# Altium schematic sheet 3.DAC_Control_CH1_V2.0-2.4.SchDoc
size A4
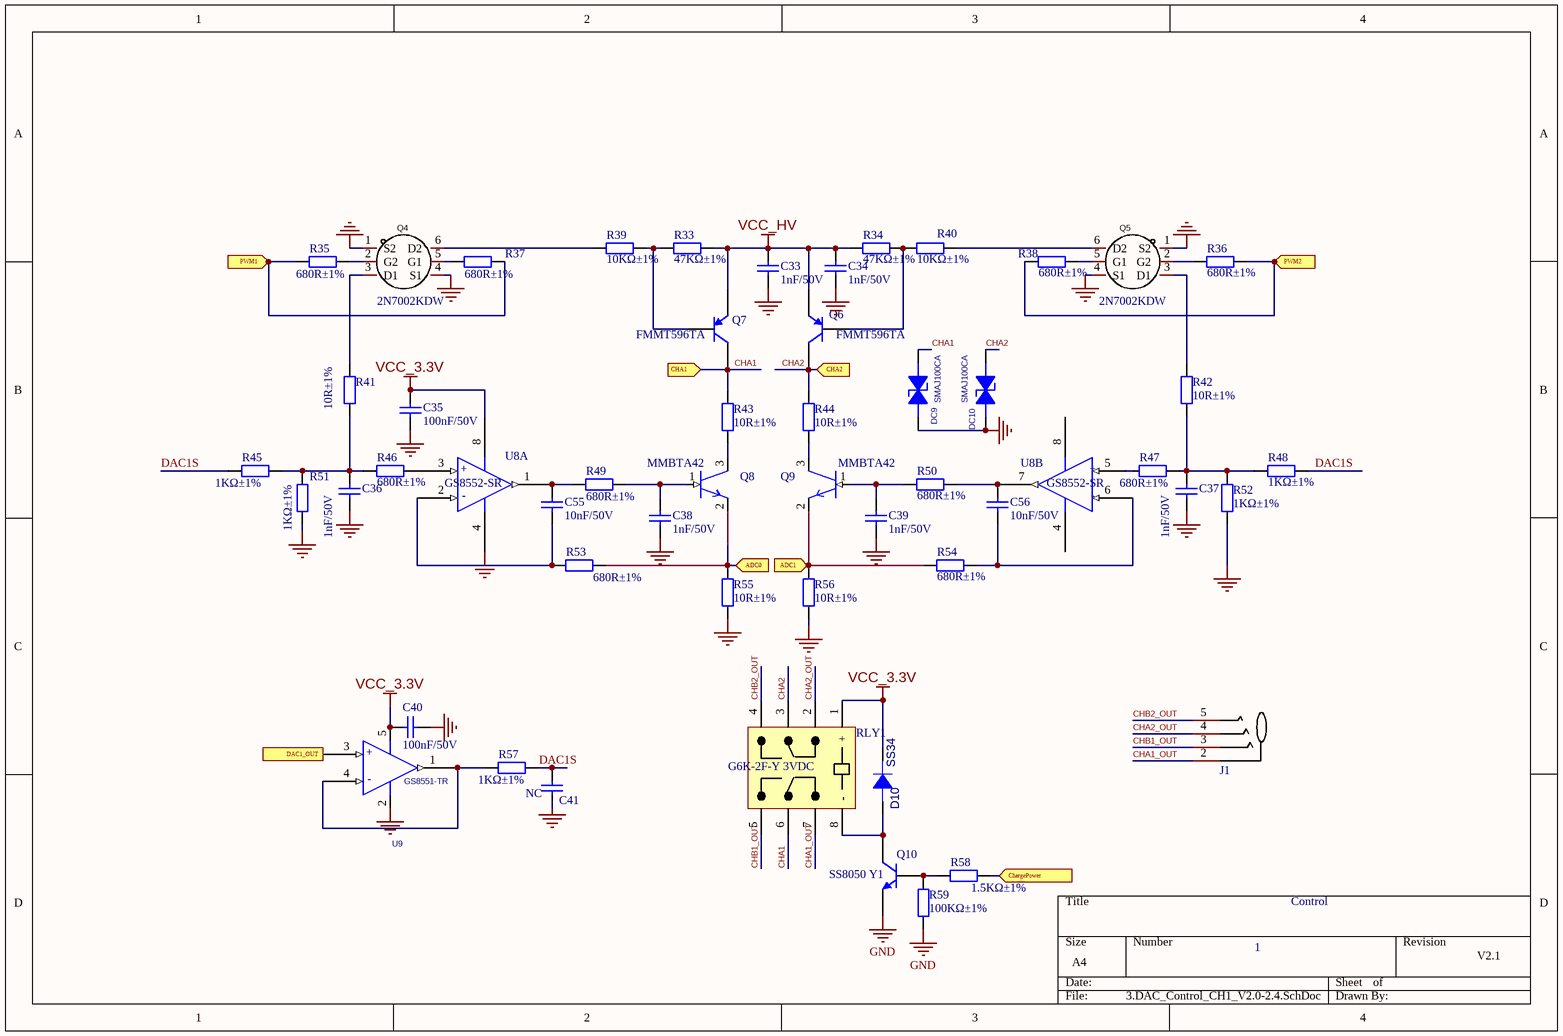
[diagram p0: 3.DAC_Control_CH1_V2.0-2.4.SchDoc]

## Parts
C33  1nF/50V  [0603C]
C34  1nF/50V  [0603C]
C35  100nF/50V  [0603C]
C36  1nF/50V  [0603C]
C37  1nF/50V  [0603C]
C38  1nF/50V  [0603C]
C39  1nF/50V  [0603C]
C40  100nF/50V  [0603C]
C41  NC  [0603C]
C55  10nF/50V  [0603C]
C56  10nF/50V  [0603C]
D10  SS34  [SMA]
DC9  SMAJ100CA  [SMA]
DC10  SMAJ100CA  [SMA]
J1  PJ-320D 贴片4脚  [AUDIO-TH_L14.1-W6.1_PJ-320D]  (value not drawn)
Q4  2N7002KDW  [SOT-363]
Q5  2N7002KDW  [SOT-363]
Q6  FMMT596TA  [SOT-23(SOT-23-3)]
Q7  FMMT596TA  [SOT-23(SOT-23-3)]
Q8  MMBTA42  [SOT-23]
Q9  MMBTA42  [SOT-23]
Q10  SS8050 Y1  [SOT-23(SOT-23-3)]
R33  47KΩ±1%  [0603R]
R34  47KΩ±1%  [0603R]
R35  680R±1%  [0603R]
R36  680R±1%  [0603R]
R37  680R±1%  [0603R]
R38  680R±1%  [0603R]
R39  10KΩ±1%  [0603R]
R40  10KΩ±1%  [0603R]
R41  10R±1%  [0603R]
R42  10R±1%  [0603R]
R43  10R±1%  [0805_R]
R44  10R±1%  [0805_R]
R45  1KΩ±1%  [0603R]
R46  680R±1%  [0603R]
R47  680R±1%  [0603R]
R48  1KΩ±1%  [0603R]
R49  680R±1%  [0603R]
R50  680R±1%  [0603R]
R51  1KΩ±1%  [0603R]
R52  1KΩ±1%  [0603R]
R53  680R±1%  [0603R]
R54  680R±1%  [0603R]
R55  10R±1%  [0805_R]
R56  10R±1%  [0805_R]
R57  1KΩ±1%  [0603R]
R58  1.5KΩ±1%  [0402_R]
R59  100KΩ±1%  [0402_R]
RLY1  G6K-2F-Y 3VDC  [HFD4/12]
U8  GS8552-SR  [SOP-8_150mil]  (parts A,B of 2)
U9  GS8551-TR  [SOT-23-5]

## Ports
ADC0 (in), ADC1 (in), CHA1 (in), CHA2 (in), ChargePower (in), DAC1_OUT (in), PWM1 (in), PWM2 (in)

## Nets
GND: C33.1 C34.1 C35.1 C36.1 C37.1 C38.1 C39.1 C40.1 C41.1 DC9.2(CATHODE) DC10.2(CATHODE) Q4.1(S2) Q4.4(S1) Q5.1(S2) Q5.4(S1) Q10.2(E) R51.1 R52.1 R55.1 R56.1 R59.1 U8.4(GND) U9.2(V-)
VCC_3.3V: C35.2 C40.2 D10.2(K) RLY1.1(+) U8.8(VCC) U9.5(V+)
VCC_HV: C33.2 C34.2 Q6.2(E) Q7.2(E) R33.1 R34.1
ADC0: Q8.2 R53.2 R55.2 ; port ADC0
ADC1: Q9.2 R54.2 R56.2 ; port ADC1
CHA1: DC9.1(ANODE) Q7.3(C) R43.2 RLY1.6 ; port CHA1
CHA1_OUT: J1.2 RLY1.7
CHA2: DC10.1(ANODE) Q6.3(C) R44.2 RLY1.3 ; port CHA2
CHA2_OUT: J1.4 RLY1.2
ChargePower: R58.1 ; port ChargePower
CHB1_OUT: J1.3 RLY1.5
CHB2_OUT: J1.5 RLY1.4
DAC1_OUT: U9.3(IN+) ; port DAC1_OUT
DAC1S: C41.2 R45.1 R48.1 R57.1
PWM1: R35.1 R37.2 ; port PWM1
PWM2: R36.1 R38.2 ; port PWM2
NetC36_2: C36.2 R41.1 R45.2 R46.1 R51.2
NetC37_2: C37.2 R42.1 R47.1 R48.2 R52.2
NetC38_2: C38.2 Q8.1 R49.2
NetC39_2: C39.2 Q9.1 R50.2
NetC55_1: C55.1 R53.1 U8.2(-IN)
NetC55_2: C55.2 R49.1 U8.1(OUT)
NetC56_1: C56.1 R54.1 U8.6(-IN)
NetC56_2: C56.2 R50.1 U8.7(OUT)
NetD10_1: D10.1(A) Q10.3(C) RLY1.8(-)
NetQ4_2: Q4.2(G2) R35.2
NetQ4_3: Q4.3(D1) R41.2
NetQ4_5: Q4.5(G1) R37.1
NetQ4_6: Q4.6(D2) R39.2
NetQ5_2: Q5.2(G2) R36.2
NetQ5_3: Q5.3(D1) R42.2
NetQ5_5: Q5.5(G1) R38.1
NetQ5_6: Q5.6(D2) R40.2
NetQ6_1: Q6.1(B) R34.2 R40.1
NetQ7_1: Q7.1(B) R33.2 R39.1
NetQ8_3: Q8.3 R43.1
NetQ9_3: Q9.3 R44.1
NetQ10_1: Q10.1(B) R58.2 R59.2
NetR46_2: R46.2 U8.3(+IN)
NetR47_2: R47.2 U8.5(+IN)
NetR57_2: R57.2 U9.1(OUT) U9.4(IN-)

## Notes on the sheet
- Control
- 1
- V2.1
- (in symbol GS8552-SR, part A) +; -
- (in symbol GS8552-SR, part B) +; -
- (in symbol OPA335AIDBVR_1) +; -

## Library data of the parts
C33 C34 = 0402 1nF (102) 10% 50V: 贴片电容; ComponentLink1Description: 供应商链接; ComponentLink1URL: http://www.szlcsc.com/product/details_1875.html; Package: 0402; Supplier: LC; SuppliersPartNumber: C1523
C35 C40 = 0402 100nF (104) 10% 16V: 贴片电容100nF 10% 50V; ComponentLink1Description: 供应商链接; ComponentLink1URL: http://www.szlcsc.com/product/details_1877.html; Package: 0402; Supplier: LC; SuppliersPartNumber: C1525
C36-C39 C55 C56 = 0402 10nF (103) 10% 50V: 贴片电容; ComponentLink1Description: 供应商链接; ComponentLink1URL: http://www.szlcsc.com/product/details_15869.html; Package: 0402; Supplier: LC; SuppliersPartNumber: C15195
C41 = 0603 10uF (106) 10% 10V: 贴片电容10uF/10V; ComponentLink1Description: 供应商链接; ComponentLink1URL: http://www.szlcsc.com/product/details_20411.html; Package: 0603; Supplier: LC; SuppliersPartNumber: C19702
D10 = DIODE_2: Schottky Barrier， DO214AA; Manufacturer: 星海; Part_Type: Schottky rectifier; Created_by: JJJ; Priority: 3A; PCB DECAL: DO-214AC; Source_Path: E:\2017\VIDEO MEETING\RK3399_VR&TABLET_V13_20170614\RK3399_VR&TABLET_V13_20170614-162.DSN; Manufacturer_PN: DO214AA; RK_PN: SS34; Value: SS34
DC9 DC10 = ESD5451X_Dup1: SMAJ100CA  SMA(DO-214AC); ID: DE-E0004; Parameter: ESD0402
J1 = PJ-320D 贴片4脚: Add into BOM: yes; Name: PJ-320D 贴片4脚; Symbol: PJ-320D 贴片4脚; Device: PJ-320D 贴片4脚; LCSC Part Name: PJ-320D 贴片4脚; Supplier Part: C9900000798; Manufacturer Part: PJ-320D 贴片4脚; Supplier Footprint: SMD; JLCPCB Part Class: Extended Part; Supplier: LCSC; Convert to PCB: yes
Q4 Q5 = 2N7002KDW: TECH PUBLIC(台舟) SOT-363; Symbol: 2N7002KDW_C2912545; Add into BOM: yes; Name: 2N7002KDW; Device: 2N7002KDW; LCSC Part Name: 2N7002KDW; Supplier Part: C2912545; Manufacturer: TECH PUBLIC(台舟); Manufacturer Part: 2N7002KDW; Supplier Footprint: SOT-363; JLCPCB Part Class: Extended Part; Datasheet: https://atta.szlcsc.com/upload/public/pdf/source/20211101/07C0903C0479EB6482C1AC89CB53F267.pdf; Supplier: LCSC; Convert to PCB: yes
Q6 Q7 = SOT-23 SS8550 Y2: 三极管; ComponentLink1Description: 供应商链接; ComponentLink1URL: http://www.szlcsc.com/product/details_9037.html; Package: SOT-23; Supplier: LC; SuppliersPartNumber: C8542
Q8 Q9 = NPN: CJ(江苏长电/长晶)
Q10 = SOT-23 SS8050 Y1: 三极管; ComponentLink1Description: 供应商链接; ComponentLink1URL: http://www.szlcsc.com/product/details_2507.html; Package: SOT-23; Supplier: LC; SuppliersPartNumber: C2150
R33 R34 R39 R40 R45 R48 R51 R52 R57 = 0402 1KΩ (1001) 1%: 贴片电阻; ComponentLink1Description: 供应商链接; ComponentLink1URL: http://www.szlcsc.com/product/details_12256.html; Package: 0402; Supplier: LC; SuppliersPartNumber: C11702
R35-R38 R46 R47 R49 R50 R53 R54 = 0402 680Ω (6800) 1%: 贴片电阻; ComponentLink1Description: 供应商链接; ComponentLink1URL: http://www.szlcsc.com/product/details_25873.html; Package: 0402; Supplier: LC; SuppliersPartNumber: C25130
R41-R44 R55 R56 = 0603 100Ω (1000) 1%: 贴片电阻; ComponentLink1Description: 供应商链接; ComponentLink1URL: http://www.szlcsc.com/product/details_23502.html; Package: 0603; Supplier: LC; SuppliersPartNumber: C22775
R58 R59 = 0402 1.5KΩ (1501) 1%: 贴片电阻; ComponentLink1Description: 供应商链接; ComponentLink1URL: http://www.szlcsc.com/product/details_26610.html; Package: 0402; Supplier: LC; SuppliersPartNumber: C25867
RLY1 = RELAY(HF)
U9 = OPA335AIDBVR_1: GS8551-TR  GS8551 SOT-23-5; Mfr_Name: Texas Instruments; Copyright: Copyright (C) 2022 Ultra Librarian. All rights reserved.; Manufacturer_Part_Number: OPA335AIDBVR